# EAGLE design M164B (EAGLE 6.6.0)
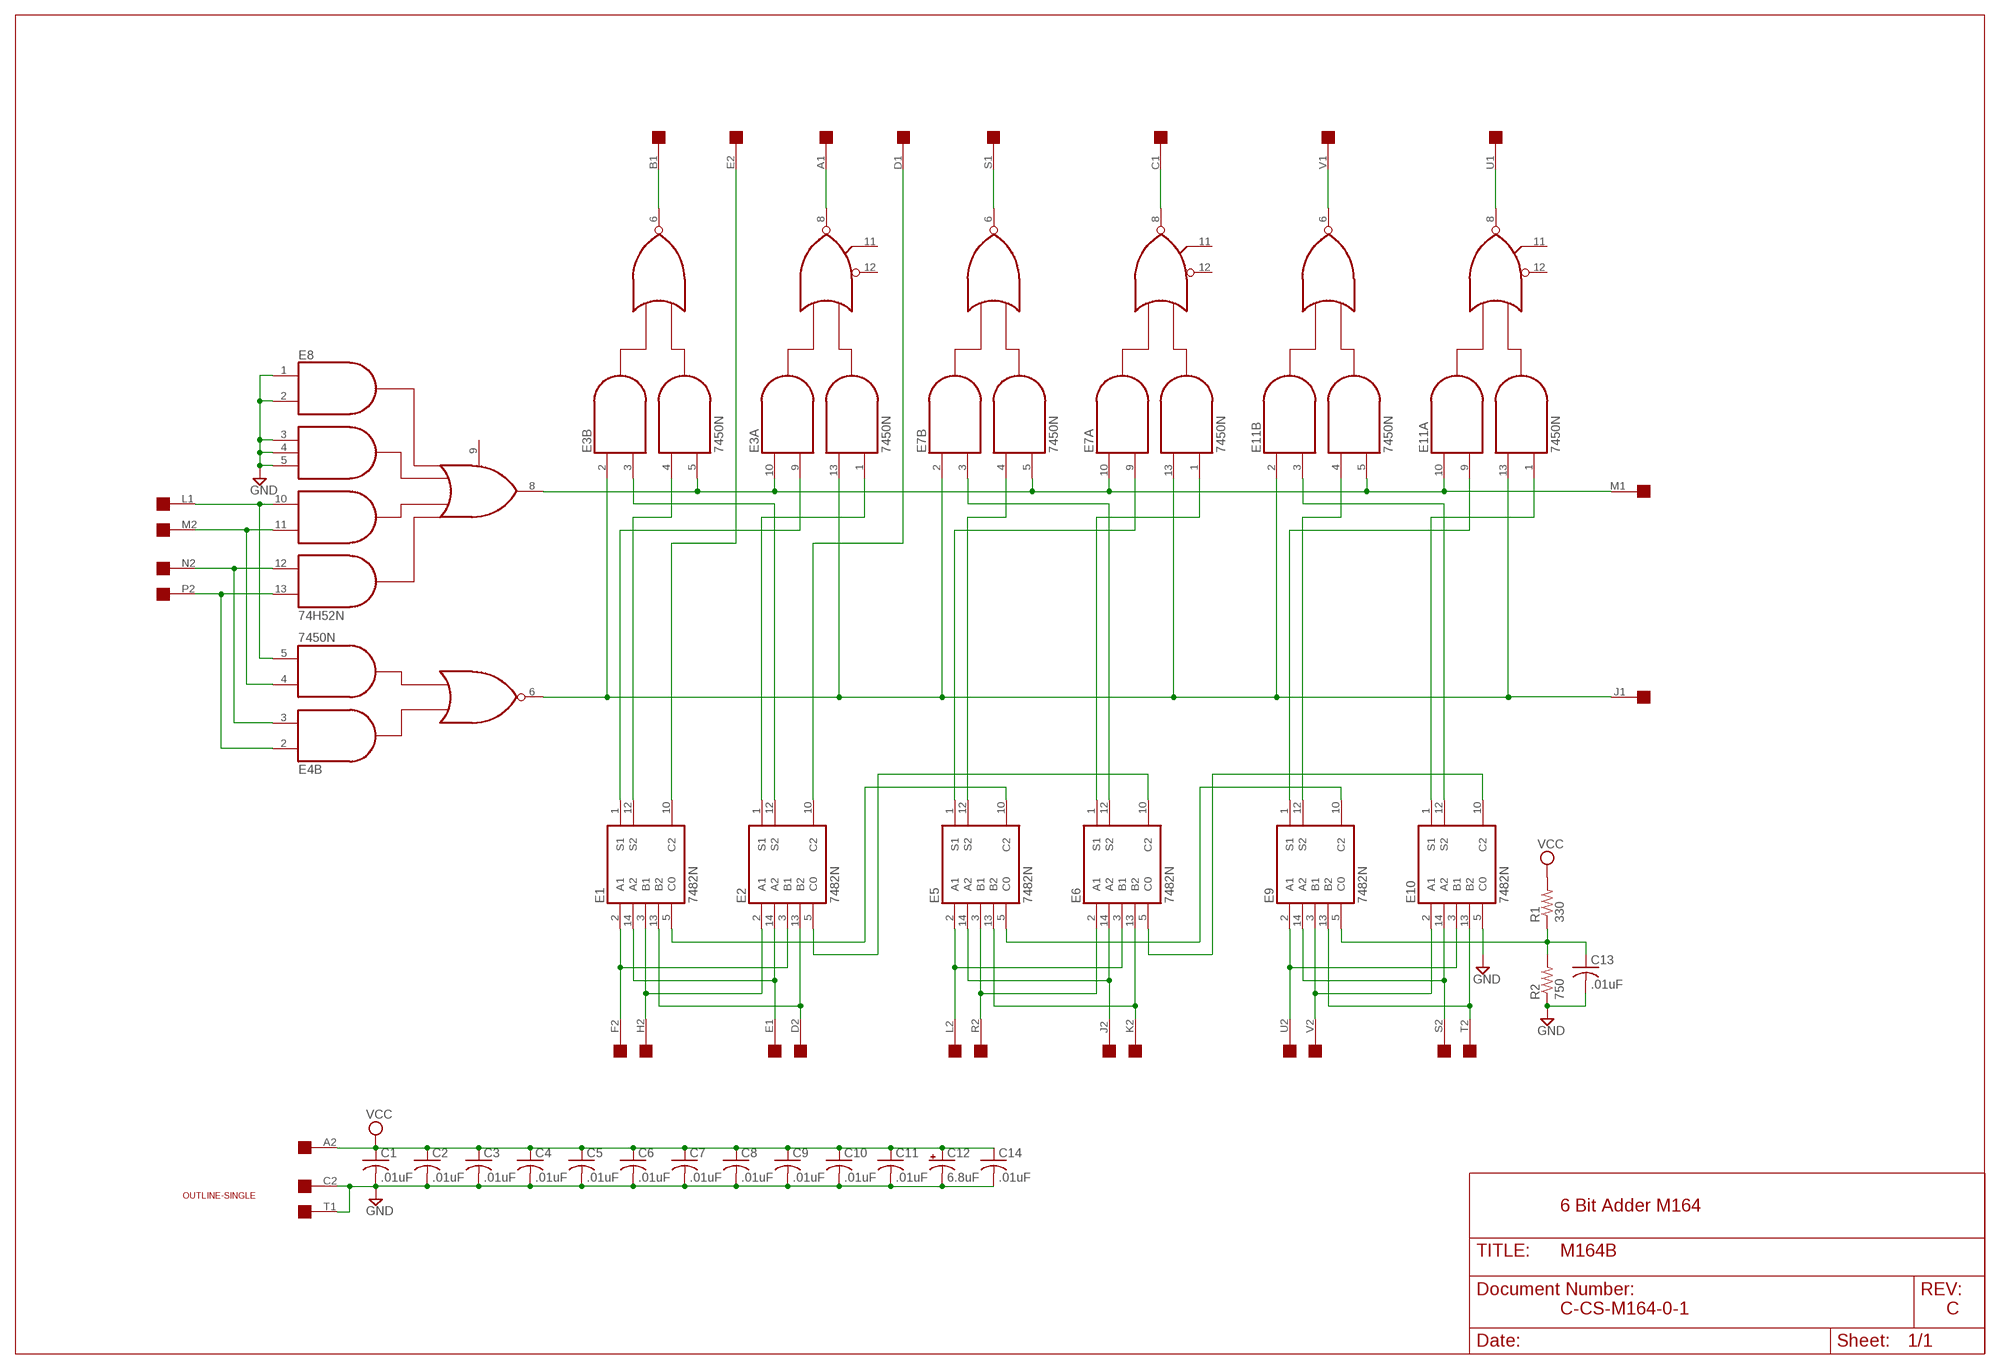
[diagram p0: schematic, sheet 1]

## Parts
C1  .01uF  C-US050-025X075  [C050-025X075]
C2  .01uF  C-US050-025X075  [C050-025X075]
C3  .01uF  C-US050-025X075  [C050-025X075]
C4  .01uF  C-US050-025X075  [C050-025X075]
C5  .01uF  C-US050-025X075  [C050-025X075]
C6  .01uF  C-US050-025X075  [C050-025X075]
C7  .01uF  C-US050-025X075  [C050-025X075]
C8  .01uF  C-US050-025X075  [C050-025X075]
C9  .01uF  C-US050-025X075  [C050-025X075]
C10  .01uF  C-US050-025X075  [C050-025X075]
C11  .01uF  C-US050-025X075  [C050-025X075]
C12  6.8uF  CPOL-USE20-8AXIAL  [E12-8]
C13  .01uF  C-US050-025X075  [C050-025X075]
C14  .01uF  C-US050-025X075  [C050-025X075]
E1  7482N  [DIL14]
E2  7482N  [DIL14]
E3  7450N  [DIL14]
E4  7450N  [DIL14]
E5  7482N  [DIL14]
E6  7482N  [DIL14]
E7  7450N  [DIL14]
E8  74H52N  74H52  [DIL14]
E9  7482N  [DIL14]
E10  7482N  [DIL14]
E11  7450N  [DIL14]
R1  330  R-US_0207/10  [0207/10]
R2  750  R-US_0207/10  [0207/10]
U$1  SINGLE  [EDGE-CON2]
U$2  OUTLINE-SINGLE  [SINGLE]

## Nets
GND [supply]: C1.2 C2.2 C3.2 C4.2 C5.2 C6.2 C7.2 C8.2 C9.2 C10.2 C11.2 C12.- C13.2 C14.2 E8.1(I1) E8.2(I2) E8.3(I3) E8.4(I4) E8.5(I5) E10.5(C0) R2.1 U$1.C2 U$1.T1
N$1: E4.3(B:I2) E8.12(I12) U$1.N2
N$2: E4.5(B:I4) E8.10(I10) U$1.L1
N$3: E4.4(B:I3) E8.11(I11) U$1.M2
N$4: E4.2(B:I1) E8.13(I13) U$1.P2
N$5: E1.2(A1) E2.3(B1) U$1.F2
N$6: E1.3(B1) E2.2(A1) U$1.H2
N$7: E1.13(B2) E2.13(B2) U$1.D2
N$8: E1.14(A2) E2.14(A2) U$1.E1
N$9: E3.2(B:I1) E3.13(A:I3) E4.6(B:O) E7.2(B:I1) E7.13(A:I3) E11.2(B:I1) E11.13(A:I3) U$1.J1
N$10: E3.5(B:I4) E3.10(A:I1) E7.5(B:I4) E7.10(A:I1) E8.8(O8) E11.5(B:I4) E11.10(A:I1) U$1.M1
N$11: E2.12(S2) E3.3(B:I2)
N$12: E1.12(S2) E3.4(B:I3)
N$13: E2.1(S1) E3.1(A:I4)
N$14: E1.1(S1) E3.9(A:I2)
N$15: E1.10(C2) U$1.E2
N$16: E2.10(C2) U$1.D1
N$17: E3.8(A:O) U$1.A1
N$18: E3.6(B:O) U$1.B1
N$19: E1.5(C0) E5.10(C2)
N$20: E2.5(C0) E6.10(C2)
N$21: E5.2(A1) E6.3(B1) U$1.L2
N$22: E5.3(B1) E6.2(A1) U$1.R2
N$23: E5.13(B2) E6.13(B2) U$1.K2
N$24: E5.14(A2) E6.14(A2) U$1.J2
N$25: C13.1 E9.5(C0) R1.1 R2.2
N$26: E9.3(B1) E10.2(A1) U$1.V2
N$27: E6.12(S2) E7.3(B:I2)
N$28: E5.12(S2) E7.4(B:I3)
N$29: E6.1(S1) E7.1(A:I4)
N$30: E5.1(S1) E7.9(A:I2)
N$33: E7.8(A:O) U$1.C1
N$34: E7.6(B:O) U$1.S1
N$36: E6.5(C0) E10.10(C2)
N$37: E9.2(A1) E10.3(B1) U$1.U2
N$39: E9.13(B2) E10.13(B2) U$1.T2
N$40: E9.14(A2) E10.14(A2) U$1.S2
N$43: E10.12(S2) E11.3(B:I2)
N$44: E9.12(S2) E11.4(B:I3)
N$45: E10.1(S1) E11.1(A:I4)
N$46: E9.1(S1) E11.9(A:I2)
N$47: E5.5(C0) E9.10(C2)
N$49: E11.8(A:O) U$1.U1
N$50: E11.6(B:O) U$1.V1
VCC [supply]: C1.1 C2.1 C3.1 C4.1 C5.1 C6.1 C7.1 C8.1 C9.1 C10.1 C11.1 C12.+ C14.1 R1.2 U$1.A2
Unconnected: E1.6 E1.7 E1.8 E1.9 E2.6 E2.7 E2.8 E2.9 E3.11(A:I6) E3.12(A:I5) E4.1(A:I4) E4.8(A:O) E4.9(A:I2) E4.10(A:I1) E4.11(A:I6) E4.12(A:I5) E4.13(A:I3) E5.6 E5.7 E5.8 E5.9 E6.6 E6.7 E6.8 E6.9 E7.11(A:I6) E7.12(A:I5) E8.6(NC) E8.9(I9) E9.6 E9.7 E9.8 E9.9 E10.6 E10.7 E10.8 E10.9 E11.11(A:I6) E11.12(A:I5) U$1.B2 U$1.F1 U$1.H1 U$1.K1 U$1.N1 U$1.P1 U$1.R1

## Notes on the sheet
- 6 Bit Adder M164
- C-CS-M164-0-1 | C

## Power pins joined to a net without a drawn wire
GND: E1.11(GND) E2.11(GND) E3.7(P:GND) E4.7(P:GND) E5.11(GND) E6.11(GND) E7.7(P:GND) E8.7(GND) E9.11(GND) E10.11(GND) E11.7(P:GND)
VCC: E1.4(VCC) E2.4(VCC) E3.14(P:VCC) E4.14(P:VCC) E5.4(VCC) E6.4(VCC) E7.14(P:VCC) E8.14(VCC) E9.4(VCC) E10.4(VCC) E11.14(P:VCC)

## Library data of the parts
C1-C11 C13 C14 = rcl:C-US: CAPACITOR, American symbol
C12 = dec-con:CPOL-USE20-8AXIAL: A 0.8 inch electrolytic.
E1 E2 E5 E6 E9 E10 = dec-con:74*82: 2-bit binary full ADDER Has the wrong GND pin in other libraries.
E3 E4 E7 E11 = dec-con:74*50: 4-2-3-2 input AND OR INVERTER gates
E8 = dec-con:74*52: Expandable 2-2-2-3 Input AND-OR gate.
R1 R2 = rcl:R-US_: RESISTOR, American symbol
U$1 = dec-con:SINGLE: Single-Height DEC board
U$2 = dec-con:OUTLINE-*: Board outlines for DEC boards.

## Net classes
1 supply: width 0.813 mm

## Board
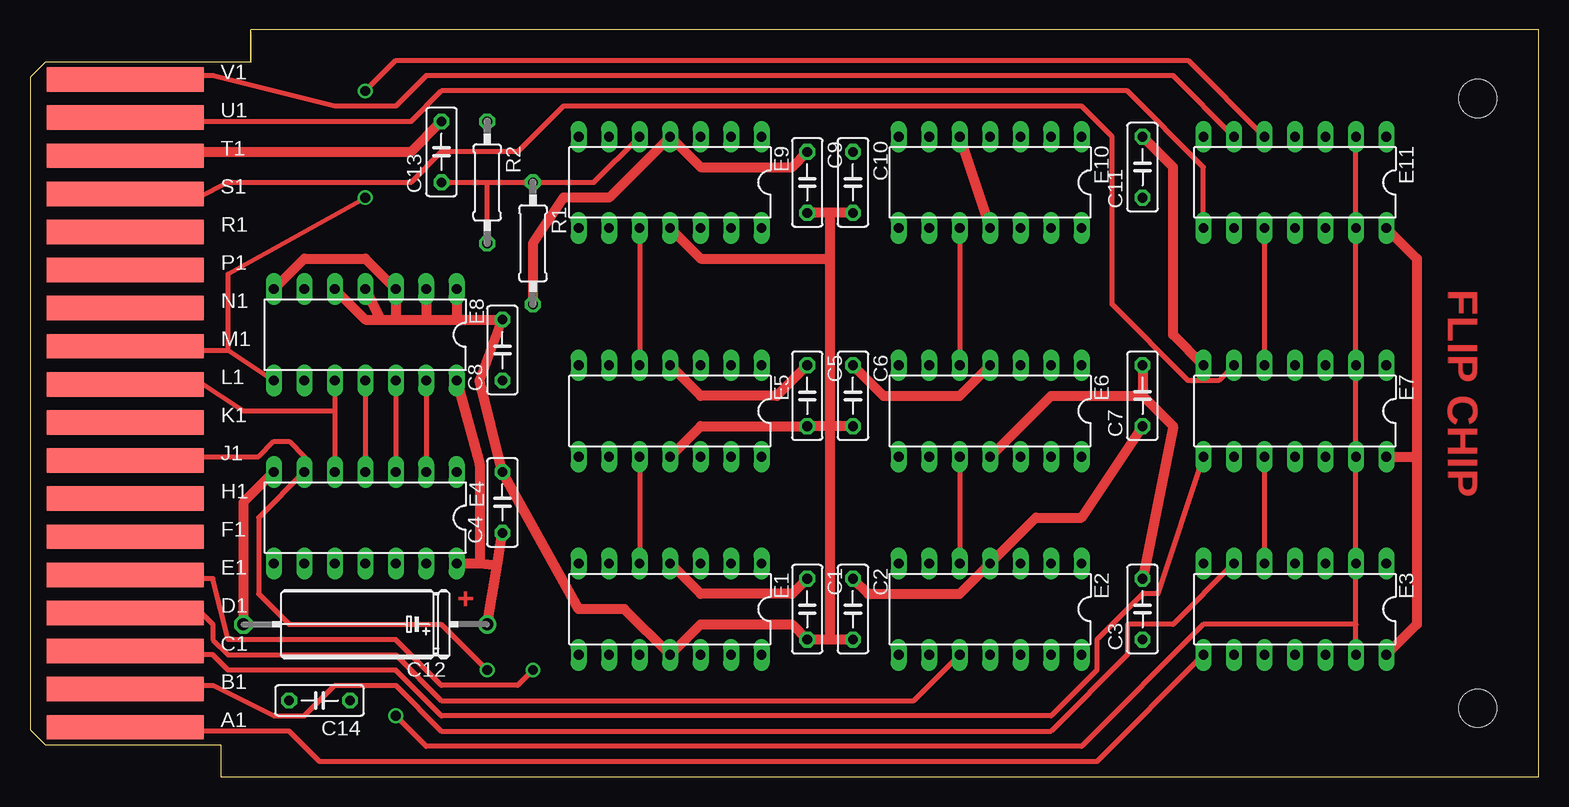
[diagram p1: board, top side]
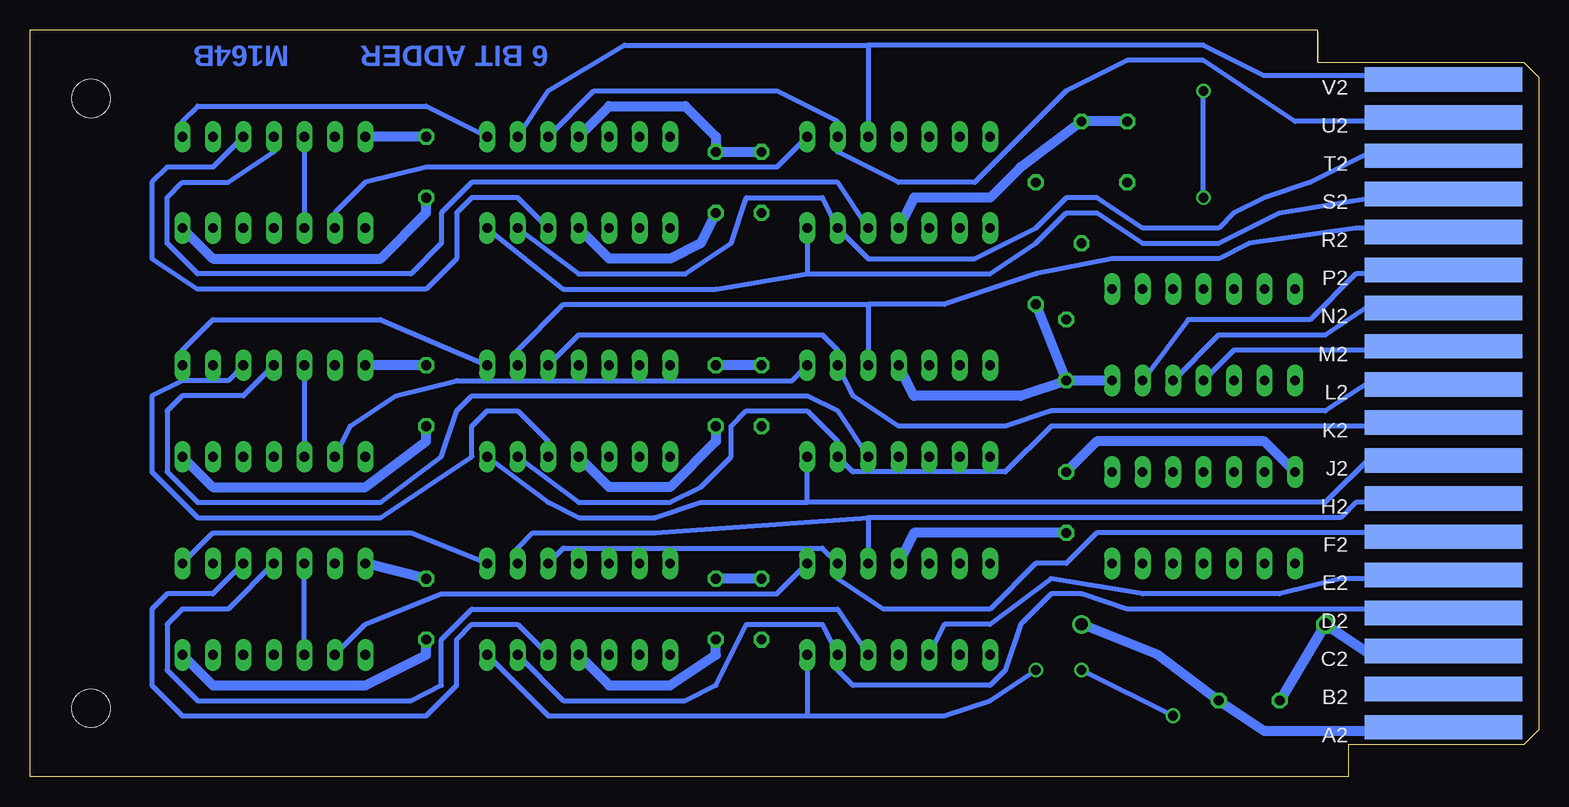
[diagram p2: board, bottom side, seen from below]

Size 125.73 x 62.23 mm. Coordinates in mm from the lower left corner, seen from the top.
Copper layers (1+16): Top 0.035mm / dielectric 1.5mm / Bottom 0.035mm
Design rules "16mils": minimum track width 16mil, minimum drill 32mil, track to track 15mil, track to pad 10mil, pad to pad 10mil, via to via 10mil, smd to smd 10mil, copper to edge 13mil, drill to drill 10mil, minimum pad ring 10mil, minimum via ring 8mil, stop-mask expansion 0mil, vias tented up to drill 0mil, thermal gap 10mil

### Footprints (pad centres in the part's own frame; a part is rotated, then mirrored left to right if it is on the bottom)
C050-025X075 = drill 0.813 octagon: 1 -2.54,0; 2 2.54,0
E12-8 = drill 1.016: + -10.16,0 | drill 1.016 octagon: - 10.16,0
DIL14 = drill 0.813 long: 1 -7.62,-3.81; 2 -5.08,-3.81; 3 -2.54,-3.81; 4 0,-3.81; 5 2.54,-3.81; 6 5.08,-3.81; 7 7.62,-3.81; 8 7.62,3.81; 9 5.08,3.81; 10 2.54,3.81; 11 0,3.81; 12 -2.54,3.81; 13 -5.08,3.81; 14 -7.62,3.81
0207/10 = drill 0.813 octagon: 1 -5.08,0; 2 5.08,0
EDGE-CON2 = smd 13.106 x 2.032: A1 7.938,4.128; B1 7.938,7.303; C1 7.938,10.477; D1 7.938,13.652; E1 7.938,16.828; F1 7.938,20.003; H1 7.938,23.177; J1 7.938,26.352; K1 7.938,29.527; L1 7.938,32.703; M1 7.938,35.877; N1 7.938,39.053; P1 7.938,42.227; R1 7.938,45.403; S1 7.938,48.578; T1 7.938,51.752; U1 7.938,54.928; V1 7.938,58.102 | smd 13.106 x 2.032 bottom: A2 7.938,4.128; B2 7.938,7.303; C2 7.938,10.477; D2 7.938,13.652; E2 7.938,16.828; F2 7.938,20.003; H2 7.938,23.177; J2 7.938,26.352; K2 7.938,29.527; L2 7.938,32.703; M2 7.938,35.877; N2 7.938,39.053; P2 7.938,42.227; R2 7.938,45.403; S2 7.938,48.578; T2 7.938,51.752; U2 7.938,54.928; V2 7.938,58.102
SINGLE = hole 3.175: 120.65,56.515; 120.65,5.715

### Placement (x,y rotation side)
C1  64.77,13.97 270 top
C2  68.58,13.97 270 top
C3  92.71,13.97 90 top
C4  39.37,22.86 90 top
C5  64.77,31.75 270 top
C6  68.58,31.75 270 top
C7  92.71,31.75 90 top
C8  39.37,35.56 90 top
C9  64.77,49.53 270 top
C10  68.58,49.53 270 top
C11  92.71,50.8 90 top
C12  27.94,12.7 180 top
C13  34.29,52.07 90 top
C14  24.13,6.35 180 top
E1  53.34,13.97 180 top
E2  80.01,13.97 180 top
E3  105.41,13.97 180 top
E4  27.94,21.59 180 top
E5  53.34,30.48 180 top
E6  80.01,30.48 180 top
E7  105.41,30.48 180 top
E8  27.94,36.83 180 top
E9  53.34,49.53 180 top
E10  80.01,49.53 180 top
E11  105.41,49.53 180 top
R1  41.91,44.45 270 top
R2  38.1,49.53 270 top
U$1  0,0 0 top
U$2  0,0 0 top

### Tracks (layer width: path | path; a pad name or v marks a point on that pad's centre or on a via)
GND
  Top 0.813: U$1.T1 8.89,52.07 31.75,52.07 C13.2 | C2.2 66.68,11.43 | 66.68,11.43 C1.2 63.5,12.7 55.88,12.7 E1.11 49.53,13.97 45.72,13.97 C4.2 37.47,33.02 C8.2 35.56,38.1 | C6.2 66.68,29.21 | 66.68,29.21 C5.2 55.88,29.21 E5.11 | C10.2 66.68,46.99 | 66.68,46.99 C9.2 | 66.68,11.43 66.68,29.21 | 66.68,29.21 66.68,43.18 | 66.68,43.18 66.68,46.99 | E7.7 95.25,36.83 95.25,50.8 C11.2 | C7.2 92.71,31.75 | 92.71,31.75 95.25,29.21 C3.2 | E6.11 85.09,31.75 92.71,31.75 | E4.7 17.78,22.86 C12.- | E10.11 E10.5 | E9.11 55.88,43.18 66.68,43.18 | E8.7 22.86,43.18 27.94,43.18 E8.3 30.48,38.1 | E8.5 27.94,38.1 29.21,38.1 | 30.48,38.1 33.02,38.1 | 33.02,38.1 35.56,38.1 | E8.4 29.21,38.1 | 29.21,38.1 30.48,38.1 | E8.2 33.02,38.1 | E8.1 35.56,38.1
  Bottom 0.813: U$1.C2 8.89,10.16 13.97,10.16 C12.- C14.2 | C13.2 R2.1 43.18,50.8 45.72,48.26 52.07,48.26 E9.11 | C7.2 E7.7 | C3.2 E3.7 | C11.2 E11.7 | C10.2 69.85,44.45 72.39,43.18 77.47,43.18 E10.11 | E2.11 77.47,7.62 72.39,7.62 68.58,10.16 C2.2 | C6.2 68.58,27.94 72.39,24.13 77.47,24.13 E6.11 | E4.7 22.86,27.94 36.83,27.94 C4.2
N$1
  Top 0.406: E8.12 E4.3
  Bottom 0.406: E8.12 26.67,36.83 17.78,36.83 13.97,39.37 8.89,39.37 U$1.N2
N$2
  Top 0.406: E8.10 25.4,30.48 | 25.4,30.48 E4.5 | U$1.L1 8.89,33.02 13.97,33.02 17.78,30.48 25.4,30.48
N$3
  Top 0.406: E8.11 E4.4
  Bottom 0.406: U$1.M2 10.16,35.56 25.4,35.56 E8.11
N$4
  Top 0.406: E8.13 E4.2
  Bottom 0.406: U$1.P2 8.89,41.91 15.24,41.91 19.05,38.1 29.21,38.1 E8.13
N$5
  Bottom 0.406: E2.3 81.28,19.05 59.69,19.05 E1.2 58.42,16.51 54.61,13.97 45.72,13.97 41.91,17.78 39.37,17.78 36.83,20.32 8.89,20.32 U$1.F2
N$6
  Bottom 0.406: E2.2 85.09,19.05 83.82,20.32 73.66,20.32 55.88,21.59 | 55.88,21.59 E1.3 | U$1.H2 8.89,22.86 15.24,22.86 16.51,21.59 55.88,21.59
N$7
  Bottom 0.406: E2.13 81.28,6.35 71.12,6.35 68.58,7.62 66.04,12.7 59.69,12.7 E1.13 58.42,8.89 57.15,7.62 45.72,7.62 44.45,8.89 43.18,12.7 40.64,15.24 38.1,15.24 34.29,13.97 10.16,13.97 U$1.D2
N$8  (via drill 0.81)
  Top 0.406: v41.91,8.89 40.64,7.62 34.29,7.62 30.48,11.43 16.51,11.43 15.24,16.51 8.89,16.51 U$1.E1
  Bottom 0.406: E1.14 60.96,5.08 | 60.96,5.08 49.53,5.08 45.72,6.35 v41.91,8.89 | E2.14 82.55,5.08 60.96,5.08
N$9  (via drill 0.81)
  Top 0.406: E11.2 E11.13 E7.2 E7.13 E3.2 110.49,12.7 | E3.13 110.49,12.7 | U$1.J1 8.89,26.67 19.05,26.67 20.32,27.94 21.59,27.94 22.86,26.67 E4.6 19.05,21.59 19.05,15.24 21.59,12.7 34.29,12.7 v38.1,8.89 | 110.49,12.7 97.79,12.7 87.63,2.54 33.02,2.54 v30.48,5.08
  Bottom 0.406: v30.48,5.08 v38.1,8.89
N$10  (via drill 0.81)
  Top 0.406: U$1.M1 8.89,35.56 16.51,35.56 | 16.51,35.56 E8.8 | 16.51,35.56 16.51,41.91 v27.94,48.26 | v27.94,57.15 30.48,59.69 96.52,59.69 E11.5 | E11.10 E7.5 | E7.10 E3.5
  Bottom 0.406: E7.5 E7.10 | E3.10 E3.5 | E11.5 E11.10 | v27.94,48.26 v27.94,57.15
N$11
  Bottom 0.406: E3.3 110.49,15.24 114.3,15.24 115.57,13.97 115.57,7.62 113.03,5.08 92.71,5.08 90.17,7.62 90.17,11.43 88.9,12.7 85.09,12.7 E2.12
N$12
  Bottom 0.406: E3.4 109.22,13.97 113.03,13.97 114.3,12.7 114.3,8.89 111.76,6.35 93.98,6.35 91.44,7.62 91.44,11.43 88.9,13.97 58.42,13.97 E1.12
N$13
  Bottom 0.406: E3.1 110.49,20.32 93.98,20.32 E2.1
N$14
  Bottom 0.406: E3.9 97.79,12.7 91.44,15.24 63.5,15.24 E1.1
N$15
  Bottom 0.406: U$1.E2 10.16,16.51 16.51,16.51 21.59,15.24 33.02,15.24 40.64,16.51 45.72,12.7 49.53,12.7 E1.10
N$16
  Top 0.406: U$1.D1 8.89,13.97 13.97,13.97 15.24,12.7 15.24,11.43 16.51,10.16 30.48,10.16 34.29,6.35 73.66,6.35 E2.10
N$17
  Top 0.406: E3.8 88.9,1.27 24.13,1.27 21.59,3.81 8.89,3.81 U$1.A1
N$18
  Top 0.406: U$1.B1 10.16,7.62 15.24,7.62 20.32,5.08 22.86,5.08 25.4,7.62 30.48,7.62 34.29,3.81 85.09,3.81 91.44,10.16 91.44,12.7 95.25,12.7 E3.6
N$19
  Top 0.406: E5.10 E1.5
N$20
  Top 0.406: E6.10 E2.5
N$21
  Bottom 0.406: U$1.L2 8.89,33.02 13.97,33.02 17.78,30.48 40.64,30.48 44.45,29.21 53.34,29.21 57.15,31.75 E5.2 58.42,35.56 59.69,36.83 60.96,36.83 80.01,36.83 E6.3
N$22
  Bottom 0.406: U$1.R2 10.16,45.72 15.24,45.72 24.13,44.45 26.67,43.18 35.56,43.18 41.91,41.91 49.53,39.37 55.88,39.37 | 55.88,39.37 E5.3 | E6.2 85.09,35.56 81.28,39.37 55.88,39.37
N$23
  Bottom 0.406: E6.13 80.01,22.86 72.39,22.86 69.85,24.13 67.31,26.67 67.31,29.21 66.04,30.48 60.96,30.48 58.42,27.94 E5.13 57.15,25.4 44.45,25.4 40.64,29.21 10.16,29.21 U$1.K2
N$24
  Bottom 0.406: E6.14 82.55,22.86 80.01,21.59 73.66,21.59 69.85,22.86 60.96,22.86 | 60.96,22.86 E5.14 | U$1.J2 10.16,26.67 13.97,26.67 17.78,22.86 60.96,22.86
N$25
  Top 0.406: C13.1 38.1,49.53 | 38.1,49.53 R1.1 46.99,49.53 E9.5 | R2.2 38.1,49.53
N$26
  Bottom 0.406: U$1.V2 8.89,58.42 22.86,58.42 27.94,60.96 55.88,60.96 | 55.88,60.96 E9.3 | E10.2 82.55,57.15 76.2,60.96 55.88,60.96
N$27
  Bottom 0.406: E7.3 109.22,33.02 113.03,33.02 115.57,31.75 115.57,25.4 111.76,21.59 96.52,21.59 88.9,26.67 88.9,29.21 87.63,30.48 85.09,30.48 82.55,27.94 E6.12
N$28
  Bottom 0.406: E7.4 107.95,31.75 113.03,31.75 114.3,30.48 114.3,25.4 111.76,22.86 96.52,22.86 91.44,26.67 90.17,30.48 88.9,31.75 60.96,31.75 58.42,30.48 E5.12
N$29
  Bottom 0.406: E7.1 113.03,35.56 110.49,38.1 96.52,38.1 E6.1
N$30
  Bottom 0.406: E7.9 99.06,29.21 95.25,31.75 90.17,33.02 62.23,33.02 E5.1
N$33
  Top 0.406: E7.8 93.98,15.24 92.71,15.24 88.9,11.43 88.9,8.89 85.09,5.08 34.29,5.08 30.48,8.89 16.51,8.89 15.24,10.16 8.89,10.16 U$1.C1
N$34
  Top 0.406: E7.6 99.06,33.02 96.52,33.02 90.17,39.37 90.17,53.34 87.63,55.88 44.45,55.88 40.64,52.07 34.29,52.07 31.75,49.53 16.51,49.53 13.97,48.26 8.89,48.26 U$1.S1
N$36
  Top 0.406: E10.10 E6.5
N$37
  Bottom 0.406: E10.3 78.74,57.15 63.5,57.15 58.42,54.61 E9.2 58.42,52.07 53.34,49.53 46.99,49.53 39.37,57.15 34.29,59.69 27.94,59.69 20.32,54.61 10.16,54.61 U$1.U2
N$39
  Bottom 0.406: U$1.T2 8.89,52.07 13.97,52.07 19.05,49.53 22.86,48.26 25.4,46.99 26.67,45.72 33.02,45.72 36.83,48.26 39.37,48.26 41.91,45.72 46.99,43.18 55.88,43.18 E9.13 59.69,48.26 66.04,48.26 67.31,44.45 71.12,41.91 80.01,41.91 E10.13
N$40
  Bottom 0.406: E9.14 60.96,41.91 | 60.96,41.91 45.72,41.91 41.91,44.45 39.37,46.99 36.83,46.99 33.02,44.45 26.67,44.45 21.59,46.99 13.97,48.26 8.89,48.26 U$1.S2 | E10.14 81.28,40.64 68.58,40.64 60.96,41.91
N$43
  Bottom 0.406: E10.12 85.09,48.26 88.9,48.26 90.17,46.99 90.17,43.18 92.71,40.64 111.76,40.64 115.57,43.18 115.57,49.53 114.3,50.8 110.49,50.8 E11.3
N$44
  Bottom 0.406: E9.12 58.42,49.53 88.9,49.53 91.44,46.99 91.44,44.45 93.98,41.91 111.76,41.91 114.3,44.45 114.3,48.26 113.03,49.53 109.22,49.53 105.41,52.07 E11.4
N$45
  Bottom 0.406: E11.1 113.03,54.61 111.76,55.88 92.71,55.88 E10.1
N$46
  Bottom 0.406: E9.1 63.5,50.8 92.71,50.8 97.79,49.53 100.33,46.99 E11.9
N$47
  Top 0.406: E9.10 E5.5
N$49
  Top 0.406: E11.8 97.79,50.8 91.44,57.15 34.29,57.15 31.75,54.61 8.89,54.61 U$1.U1
N$50
  Top 0.406: E11.6 95.25,58.42 33.02,58.42 30.48,55.88 25.4,55.88 15.24,58.42 8.89,58.42 U$1.V1
VCC
  Top 0.813: R1.2 41.91,44.45 44.45,48.26 48.26,48.26 E9.4 55.88,50.8 63.5,50.8 C9.1 | C12.+ 38.92,17.64 | 38.92,17.64 C4.1 | E4.14 37.47,17.78 | 37.47,17.78 38.92,17.64 | E8.14 37.47,26.04 37.47,17.78 | E11.14 115.57,43.18 115.57,26.67 | E7.14 115.57,26.67 | 115.57,26.67 115.57,12.7 E3.14 | C1.1 63.5,15.24 55.88,15.24 E1.4 | C5.1 62.23,31.75 55.88,31.75 E5.4 | C6.1 71.12,31.75 77.47,31.75 E6.4 | C2.1 69.85,15.24 77.47,15.24 E2.4 83.82,21.59 87.63,21.59 C7.1
  Bottom 0.813: C12.+ 31.75,10.16 C14.1 22.86,3.81 10.16,3.81 U$1.A2 | R1.2 C8.1 | E8.14 C8.1 | C8.1 43.18,31.75 52.07,31.75 E5.4 | E10.4 77.47,55.88 71.12,55.88 68.58,53.34 C10.1 C9.1 | E11.14 110.49,43.18 96.52,43.18 92.71,46.99 C11.1 | E7.14 110.49,24.13 97.79,24.13 92.71,27.94 C7.1 | E3.14 110.49,7.62 97.79,7.62 92.71,10.16 C3.1 | C1.1 C2.1 | C5.1 C6.1 | C4.1 52.07,20.32 E1.4

### Text on the board
Top: FLIP CHIP | +
Bottom: 6 BIT ADDER | M164B